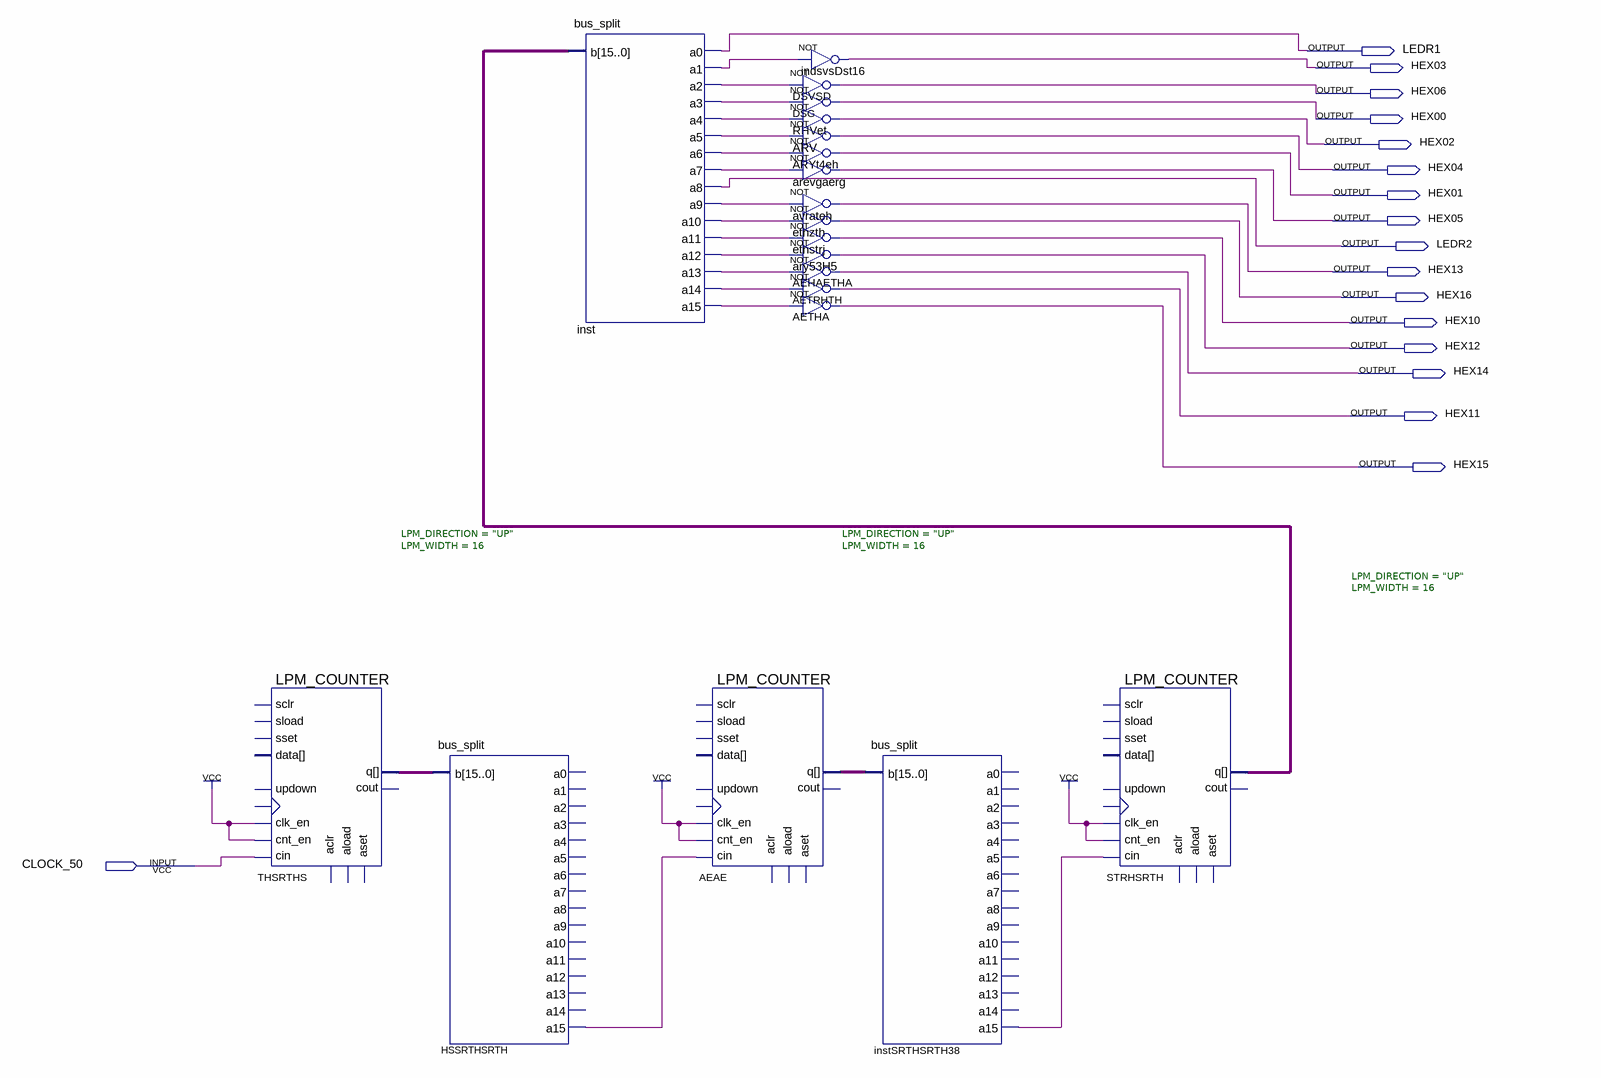
[diagram p0: schematic sheet]
// Quartus schematic random_testing.bdf as structural Verilog: 20 symbols, 17 pins
module random_testing (
  input  CLOCK_50,
  output LEDR1,
  output HEX03,
  output HEX06,
  output HEX00,
  output HEX02,
  output HEX04,
  output HEX01,
  output HEX05,
  output LEDR2,
  output HEX13,
  output HEX16,
  output HEX10,
  output HEX12,
  output HEX14,
  output HEX11,
  output HEX15
);

  wire HSSRTHSRTH_a15, inst_a1, inst_a2, inst_a3, inst_a4, inst_a5, inst_a6, inst_a7, inst_a9, inst_a10,
       inst_a11, inst_a12, inst_a13, inst_a14, inst_a15, instSRTHSRTH38_a15;
  wire [15:0] AEAE_q, STRHSRTH_q, THSRTHS_q;

  LPM_COUNTER #(.LPM_DIRECTION("UP"), .LPM_WIDTH(16)) THSRTHS (
    .clk_en(1'b1), .cin(CLOCK_50), .cnt_en(1'b1), .q(THSRTHS_q));  // open: sload, data, clock, aload, aclr, aset, sset, updown, sclr, cout
  bus_split HSSRTHSRTH (
    .b(THSRTHS_q), .a15(HSSRTHSRTH_a15));  // open: a0, a1, a2, a3, a4, a5, a6, a7, a8, a9, a10, a11, a12, a13, a14
  bus_split inst (
    .b(STRHSRTH_q), .a0(LEDR1), .a1(inst_a1), .a2(inst_a2), .a3(inst_a3), .a4(inst_a4), .a5(inst_a5),
    .a6(inst_a6), .a7(inst_a7), .a8(LEDR2), .a9(inst_a9), .a10(inst_a10), .a11(inst_a11), .a12(inst_a12),
    .a13(inst_a13), .a14(inst_a14), .a15(inst_a15));
  LPM_COUNTER #(.LPM_DIRECTION("UP"), .LPM_WIDTH(16)) AEAE (
    .clk_en(1'b1), .cin(HSSRTHSRTH_a15), .cnt_en(1'b1), .q(AEAE_q));  // open: sload, data, clock, aload, aclr, aset, sset, updown, sclr, cout
  not DSVSD (HEX06, inst_a2);
  not DSG (HEX00, inst_a3);
  not RHVet (HEX02, inst_a4);
  not ARV (HEX04, inst_a5);
  not ARYt4eh (HEX01, inst_a6);
  not arevgaerg (HEX05, inst_a7);
  not avrateh (HEX13, inst_a9);
  not ethzth (HEX16, inst_a10);
  not ethstrj (HEX10, inst_a11);
  not ary53H5 (HEX12, inst_a12);
  not AEHAETHA (HEX14, inst_a13);
  not AETRHTH (HEX11, inst_a14);
  not AETHA (HEX15, inst_a15);
  not indsvsDst16 (HEX03, inst_a1);
  bus_split instSRTHSRTH38 (
    .b(AEAE_q), .a15(instSRTHSRTH38_a15));  // open: a0, a1, a2, a3, a4, a5, a6, a7, a8, a9, a10, a11, a12, a13, a14
  LPM_COUNTER #(.LPM_DIRECTION("UP"), .LPM_WIDTH(16)) STRHSRTH (
    .clk_en(1'b1), .cin(instSRTHSRTH38_a15), .cnt_en(1'b1), .q(STRHSRTH_q));  // open: sload, data, clock, aload, aclr, aset, sset, updown, sclr, cout
endmodule
